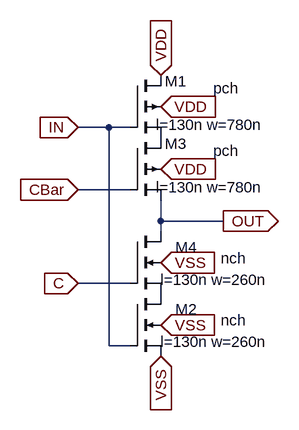
[diagram p0: schematic Inverter3state.asc]
Inverter3state.asc, the LTspice schematic file:
Version 4.1
SHEET 1 880 680
WIRE 64 128 16 128
WIRE 96 128 64 128
WIRE 96 224 16 224
WIRE 144 272 144 240
WIRE 240 272 144 272
WIRE 144 288 144 272
WIRE 96 368 16 368
WIRE 64 464 64 128
WIRE 96 464 64 464
FLAG 240 272 OUT
IOPIN 240 272 Out
FLAG 144 48 VDD
IOPIN 144 48 In
FLAG 144 96 VDD
IOPIN 144 96 In
FLAG 144 192 VDD
IOPIN 144 192 In
FLAG 144 480 VSS
IOPIN 144 480 In
FLAG 144 432 VSS
IOPIN 144 432 In
FLAG 144 336 VSS
IOPIN 144 336 In
FLAG 16 224 CBar
IOPIN 16 224 In
FLAG 16 368 C
IOPIN 16 368 In
FLAG 16 128 IN
IOPIN 16 128 In
SYMBOL pmos4 96 48 R0
WINDOW 0 88 9 Right 2
WINDOW 3 168 20 Right 2
WINDOW 123 206 76 Right 2
SYMATTR InstName M1
SYMATTR Value pch
SYMATTR Value2 l=130n w=780n
SYMBOL nmos4 96 384 R0
WINDOW 0 104 24 Right 2
WINDOW 3 179 41 Right 2
WINDOW 123 213 74 Right 2
SYMATTR InstName M2
SYMATTR Value nch
SYMATTR Value2 l=130n w=260n
SYMBOL pmos4 96 144 R0
WINDOW 0 88 9 Right 2
WINDOW 3 168 20 Right 2
WINDOW 123 206 76 Right 2
SYMATTR InstName M3
SYMATTR Value pch
SYMATTR Value2 l=130n w=780n
SYMBOL nmos4 96 288 R0
WINDOW 0 104 24 Right 2
WINDOW 3 179 41 Right 2
WINDOW 123 213 74 Right 2
SYMATTR InstName M4
SYMATTR Value nch
SYMATTR Value2 l=130n w=260n

The netlist it stands for:
* Inverter3state.asc
M1 VDD IN P001 VDD pch l=130n w=780n
M2 P002 IN VSS VSS nch l=130n w=260n
M3 P001 CBar OUT VDD pch l=130n w=780n
M4 OUT C P002 VSS nch l=130n w=260n
.model NMOS NMOS
.model PMOS PMOS
.lib standard.mos
.backanno
.end